# EAGLE design multiplex (EAGLE 7.2.0)

## Sheet 1 of 3
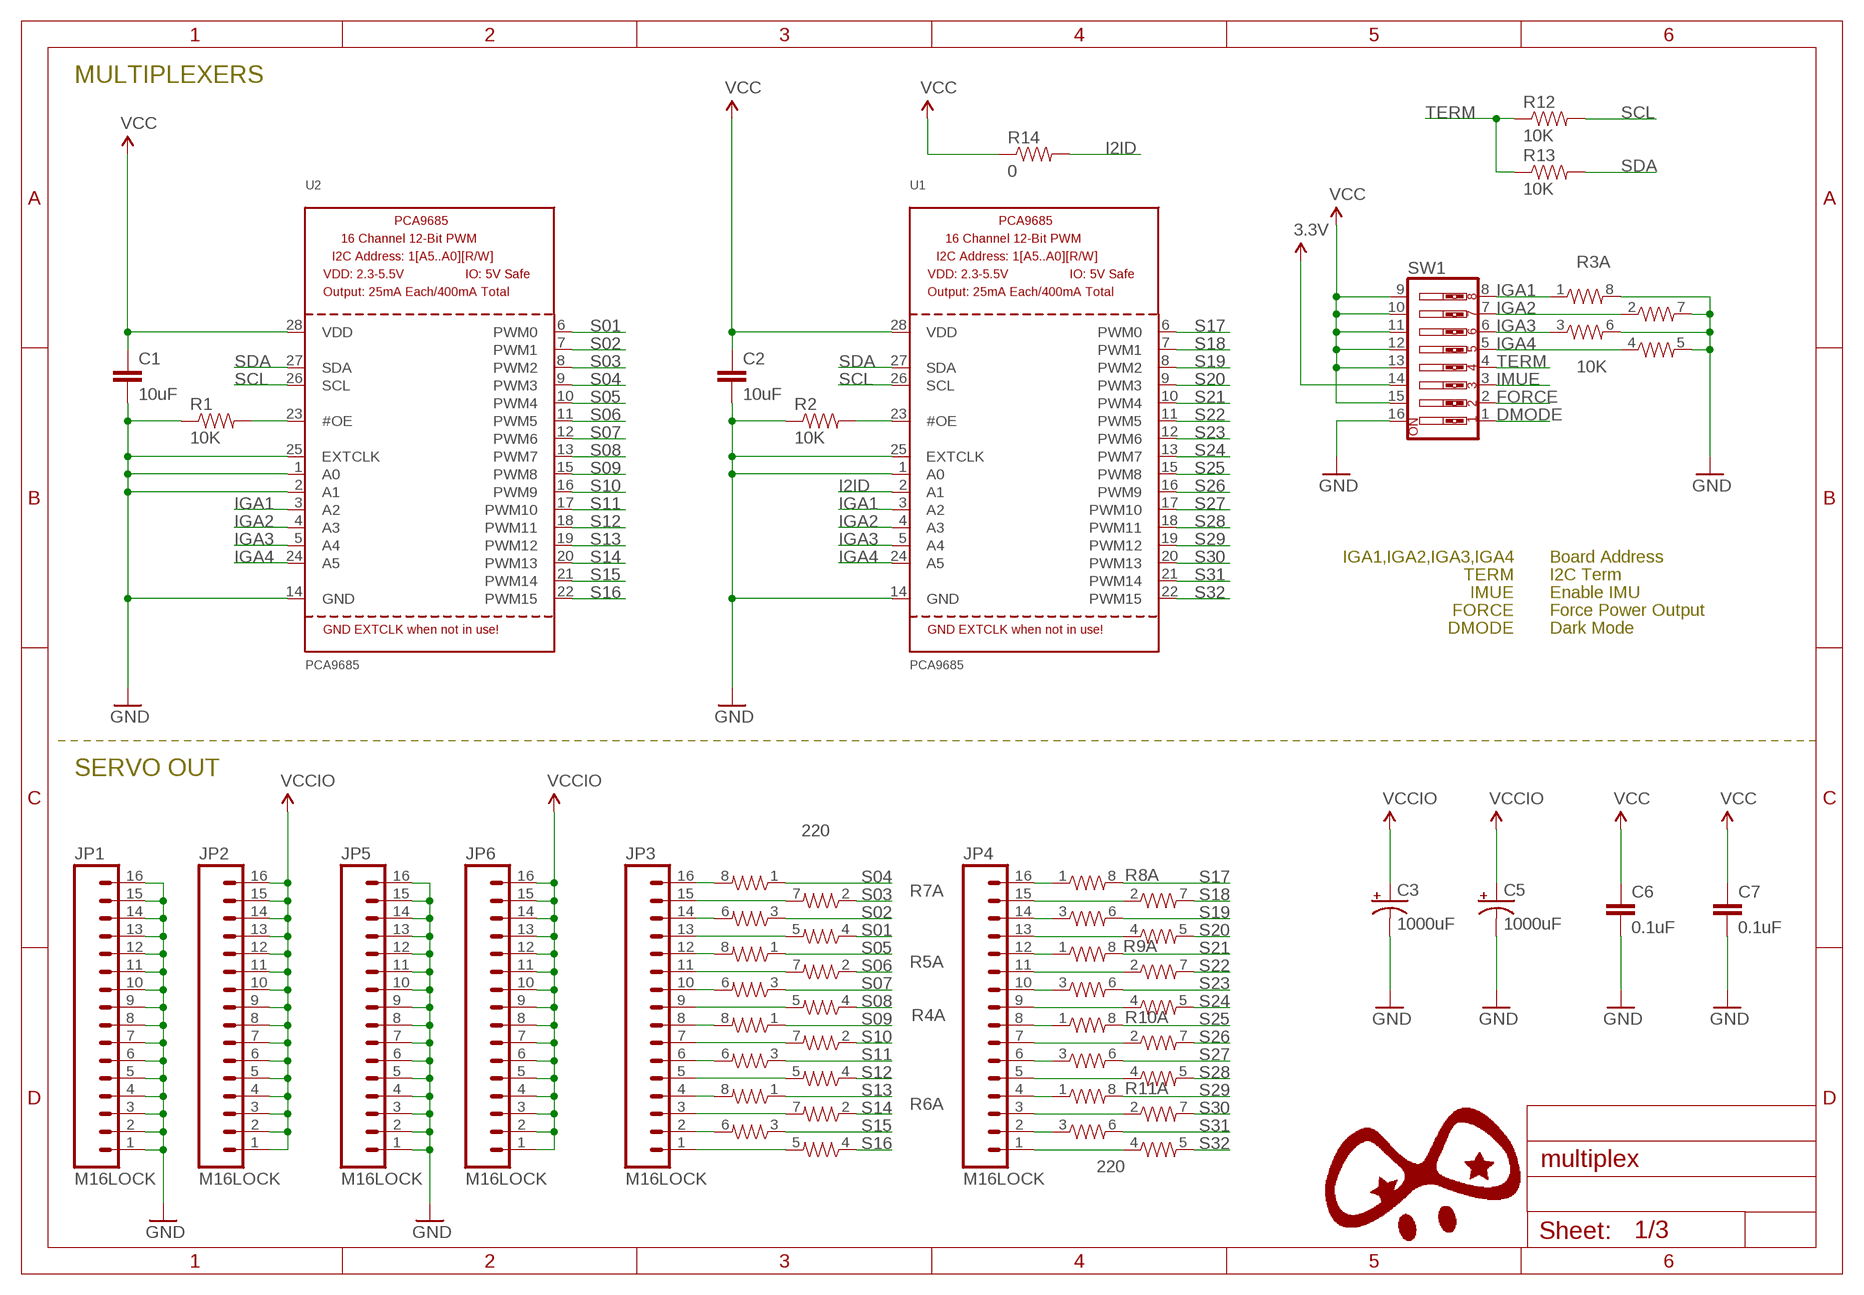
[diagram p0: schematic, sheet 1]

### Parts
C1  10uF  10UF-6.3V-20%(0603)  [0603-CAP]
C2  10uF  10UF-6.3V-20%(0603)  [0603-CAP]
C3  1000uF  CAP_POLD  [PANASONIC_D]
C5  1000uF  CAP_POLD  [PANASONIC_D]
C6  0.1uF  10UF-6.3V-20%(0603)  [0603-CAP]
C7  0.1uF  10UF-6.3V-20%(0603)  [0603-CAP]
JP1  M16LOCK  [1X16_LOCK]
JP2  M16LOCK  [1X16_LOCK]
JP3  M16LOCK  [1X16_LOCK]
JP4  M16LOCK  [1X16_LOCK]
JP5  M16LOCK  [1X16_LOCK]
JP6  M16LOCK  [1X16_LOCK]
R1  10K  RESISTOR0603  [0603-RES]
R2  10K  RESISTOR0603  [0603-RES]
R3  10K  RESISTOR-ARRAY0603-ARV  [0603-ARV]
R4  220  RESISTOR-ARRAY0603-ARV  [0603-ARV]
R5  220  RESISTOR-ARRAY0603-ARV  [0603-ARV]
R6  220  RESISTOR-ARRAY0603-ARV  [0603-ARV]
R7  220  RESISTOR-ARRAY0603-ARV  [0603-ARV]
R8  220  RESISTOR-ARRAY0603-ARV  [0603-ARV]
R9  220  RESISTOR-ARRAY0603-ARV  [0603-ARV]
R10  220  RESISTOR-ARRAY0603-ARV  [0603-ARV]
R11  220  RESISTOR-ARRAY0603-ARV  [0603-ARV]
R12  10K  RESISTOR0603  [0603-RES]
R13  10K  RESISTOR0603  [0603-RES]
R14  0  RESISTOR0603  [0603-RES]
SW1  SW_DIP-8-SMT-HALFSIZE  [DIPSWITCH-08-50MIL]
U1  PCA9685  [TSSOP28]
U2  PCA9685  [TSSOP28]

### Nets
3.3V: SW1.14 ; also sheet 2,3
DMODE: SW1.1 ; also sheet 2
FORCE: SW1.2 ; also sheet 3
GND [PlanGND]: C1.2 C2.2 C3.- C5.- C6.2 C7.2 JP1.1 JP1.2 JP1.3 JP1.4 JP1.5 JP1.6 JP1.7 JP1.8 JP1.9 JP1.10 JP1.11 JP1.12 JP1.13 JP1.14 JP1.15 JP1.16 JP5.1 JP5.2 JP5.3 JP5.4 JP5.5 JP5.6 JP5.7 JP5.8 JP5.9 JP5.10 JP5.11 JP5.12 JP5.13 JP5.14 JP5.15 JP5.16 R1.1 R2.1 R3.5 R3.6 R3.7 R3.8 SW1.16 U1.1(A0) U1.14(GND) U1.25(EXTCLK) U2.1(A0) U2.2(A1) U2.14(GND) U2.25(EXTCLK) ; also sheet 2,3
I2ID: R14.2 U1.2(A1)
IGA1: R3.1 SW1.8 U1.3(A2) U2.3(A2) ; also sheet 3
IGA2: R3.2 SW1.7 U1.4(A3) U2.4(A3) ; also sheet 3
IGA3: R3.3 SW1.6 U1.5(A4) U2.5(A4) ; also sheet 3
IGA4: R3.4 SW1.5 U1.24(A5) U2.24(A5) ; also sheet 3
IMUE: SW1.3 ; also sheet 2
N$1: JP3.16 R7.8
N$2: JP3.15 R7.7
N$3: R1.2 U2.23(#OE)
N$4: R2.2 U1.23(#OE)
N$5: JP3.14 R7.6
N$6: JP3.13 R7.5
N$7: JP3.11 R5.7
N$8: JP3.12 R5.8
N$9: JP3.10 R5.6
N$10: JP3.9 R5.5
N$11: JP3.8 R4.8
N$12: JP3.7 R4.7
N$13: JP3.6 R4.6
N$14: JP3.5 R4.5
N$15: JP3.4 R6.8
N$16: JP3.3 R6.7
N$17: JP3.2 R6.6
N$18: JP3.1 R6.5
N$35: JP4.16 R8.1
N$36: JP4.15 R8.2
N$37: JP4.14 R8.3
N$38: JP4.13 R8.4
N$39: JP4.12 R9.1
N$40: JP4.11 R9.2
N$41: JP4.10 R9.3
N$42: JP4.9 R9.4
N$43: JP4.8 R10.1
N$44: JP4.7 R10.2
N$45: JP4.6 R10.3
N$46: JP4.5 R10.4
N$47: JP4.4 R11.1
N$48: JP4.3 R11.2
N$49: JP4.2 R11.3
N$50: JP4.1 R11.4
S01: R7.4 U2.6(PWM0)
S02: R7.3 U2.7(PWM1)
S03: R7.2 U2.8(PWM2)
S04: R7.1 U2.9(PWM3)
S05: R5.1 U2.10(PWM4)
S06: R5.2 U2.11(PWM5)
S07: R5.3 U2.12(PWM6)
S08: R5.4 U2.13(PWM7)
S09: R4.1 U2.15(PWM8)
S10: R4.2 U2.16(PWM9)
S11: R4.3 U2.17(PWM10)
S12: R4.4 U2.18(PWM11)
S13: R6.1 U2.19(PWM12)
S14: R6.2 U2.20(PWM13)
S15: R6.3 U2.21(PWM14)
S16: R6.4 U2.22(PWM15)
S17: R8.8 U1.6(PWM0)
S18: R8.7 U1.7(PWM1)
S19: R8.6 U1.8(PWM2)
S20: R8.5 U1.9(PWM3)
S21: R9.8 U1.10(PWM4)
S22: R9.7 U1.11(PWM5)
S23: R9.6 U1.12(PWM6)
S24: R9.5 U1.13(PWM7)
S25: R10.8 U1.15(PWM8)
S26: R10.7 U1.16(PWM9)
S27: R10.6 U1.17(PWM10)
S28: R10.5 U1.18(PWM11)
S29: R11.8 U1.19(PWM12)
S30: R11.7 U1.20(PWM13)
S31: R11.6 U1.21(PWM14)
S32: R11.5 U1.22(PWM15)
SCL: R12.2 U1.26(SCL) U2.26(SCL) ; also sheet 2,3
SDA: R13.2 U1.27(SDA) U2.27(SDA) ; also sheet 2,3
TERM: R12.1 R13.1 SW1.4
VCC: C1.1 C2.1 C6.1 C7.1 R14.1 SW1.9 SW1.10 SW1.11 SW1.12 SW1.13 SW1.15 U1.28(VDD) U2.28(VDD) ; also sheet 2,3
VCCIO: C3.+ C5.+ JP2.1 JP2.2 JP2.3 JP2.4 JP2.5 JP2.6 JP2.7 JP2.8 JP2.9 JP2.10 JP2.11 JP2.12 JP2.13 JP2.14 JP2.15 JP2.16 JP6.1 JP6.2 JP6.3 JP6.4 JP6.5 JP6.6 JP6.7 JP6.8 JP6.9 JP6.10 JP6.11 JP6.12 JP6.13 JP6.14 JP6.15 JP6.16 ; also sheet 2,3

### Notes on the sheet
- MULTIPLEXERS
- IGA1,IGA2,IGA3,IGA4 | Board Address
- TERM | I2C Term
- IMUE | Enable IMU
- FORCE | Force Power Output
- DMODE | Dark Mode
- SERVO OUT

## Sheet 2 of 3
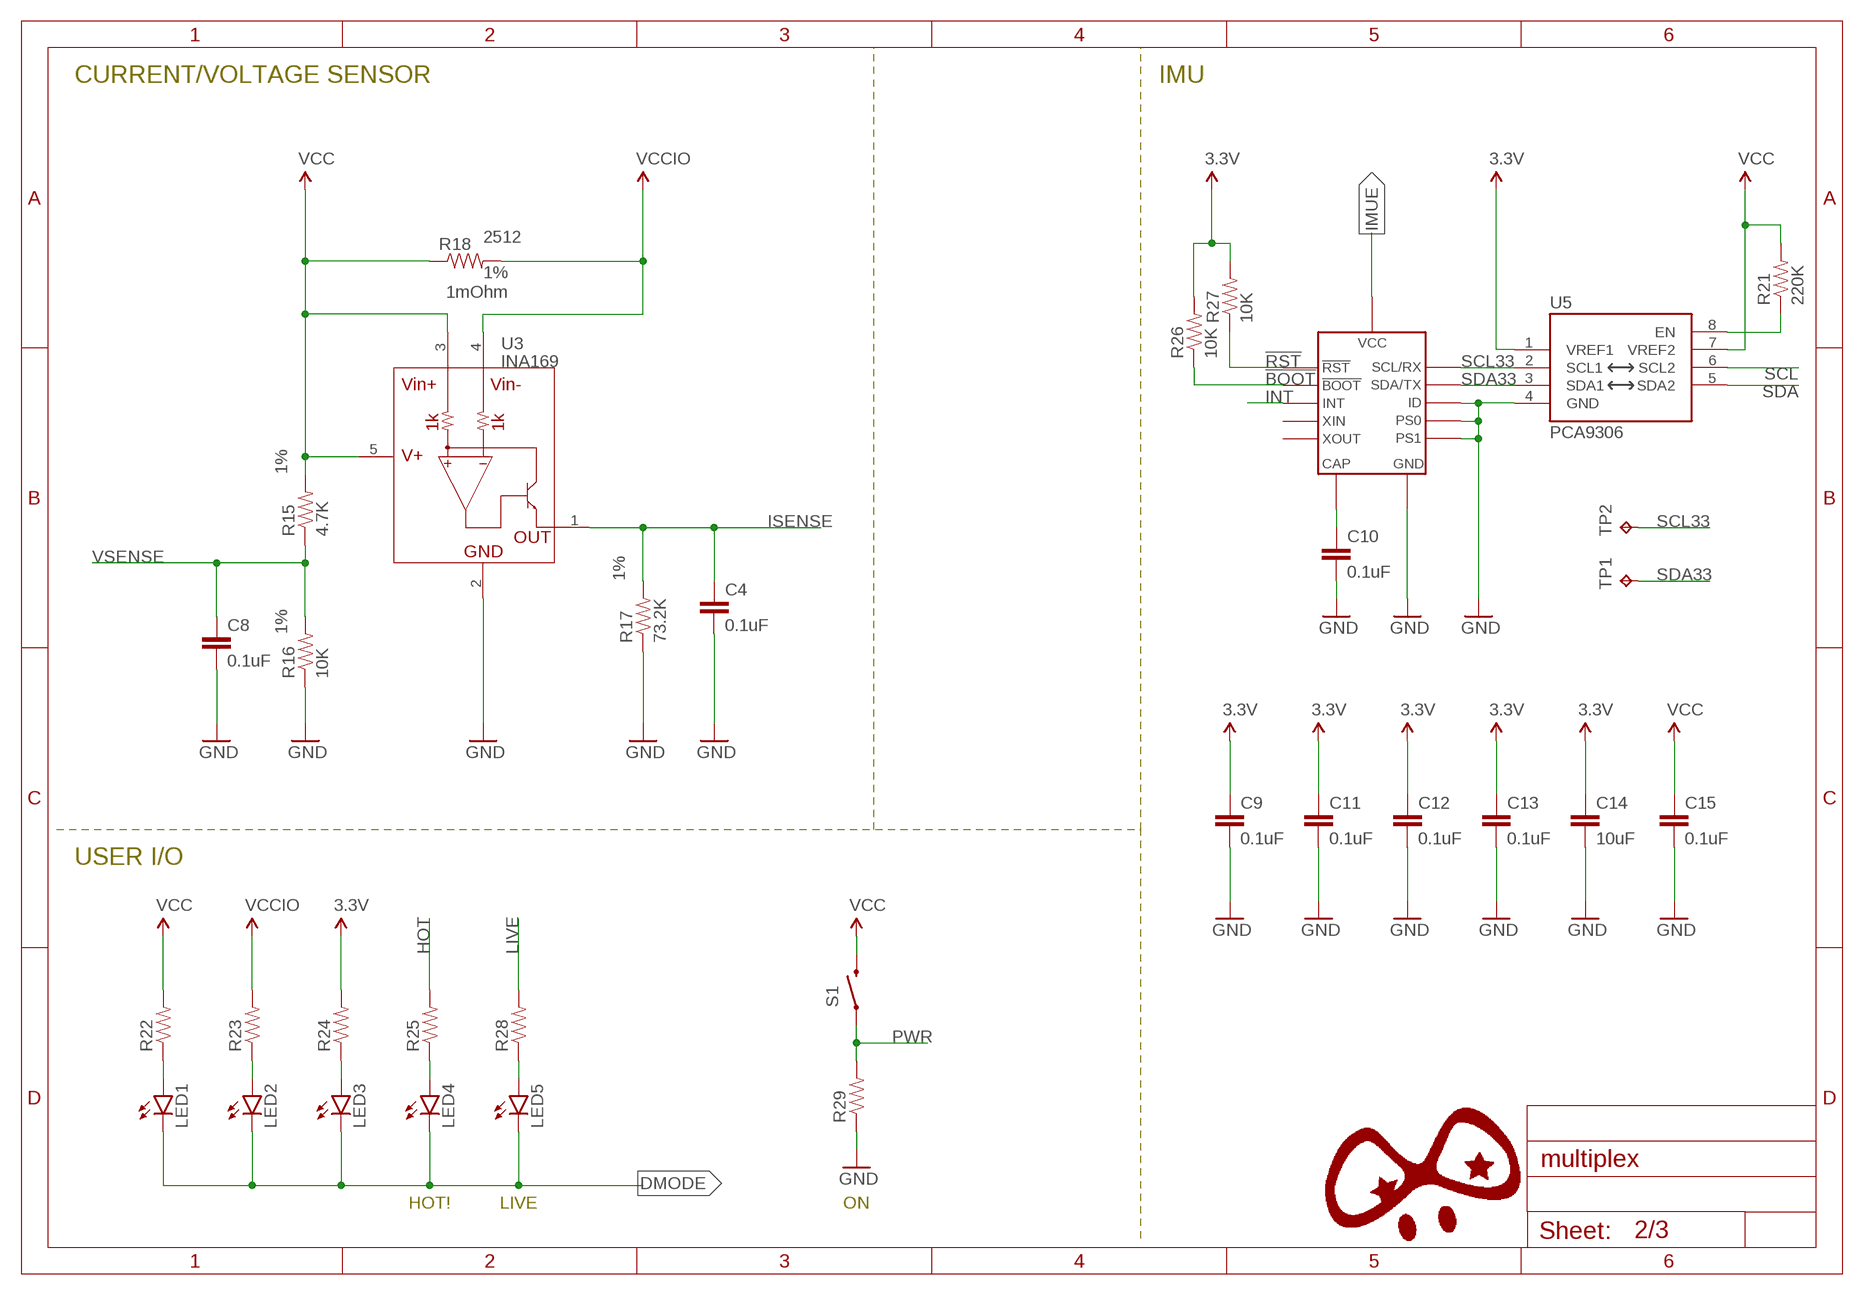
[diagram p1: schematic, sheet 2]

### Parts
C4  0.1uF  10UF-6.3V-20%(0603)  [0603-CAP]
C8  0.1uF  10UF-6.3V-20%(0603)  [0603-CAP]
C9  0.1uF  10UF-6.3V-20%(0603)  [0603-CAP]
C10  0.1uF  10UF-6.3V-20%(0603)  [0603-CAP]
C11  0.1uF  10UF-6.3V-20%(0603)  [0603-CAP]
C12  0.1uF  10UF-6.3V-20%(0603)  [0603-CAP]
C13  0.1uF  10UF-6.3V-20%(0603)  [0603-CAP]
C14  10uF  10UF-6.3V-20%(0603)  [0603-CAP]
C15  0.1uF  10UF-6.3V-20%(0603)  [0603-CAP]
LED1  LED0603  [LED-0603]
LED2  LED0603  [LED-0603]
LED3  LED0603  [LED-0603]
LED4  LED0603  [LED-0603]
LED5  LED0603  [LED-0603]
R15  4.7K  RESISTOR0603  [0603-RES]
R16  10K  RESISTOR0603  [0603-RES]
R17  73.2K  RESISTOR0603  [0603-RES]
R18  1mOhm  RESISTOR2512  [R2512]
R21  220K  RESISTOR0603-RES  [0603-RES]
R22  RESISTOR0603-RES  [0603-RES]
R23  RESISTOR0603-RES  [0603-RES]
R24  RESISTOR0603-RES  [0603-RES]
R25  RESISTOR0603-RES  [0603-RES]
R26  10K  RESISTOR0603  [0603-RES]
R27  10K  RESISTOR0603  [0603-RES]
R28  RESISTOR0603-RES  [0603-RES]
R29  RESISTOR0603-RES  [0603-RES]
S1  SWITCH-MOMENTARY-2SMD  [TACTILE-SWITCH-SMD]
TP1  TPB1,27  [B1,27]
TP2  TPB1,27  [B1,27]
U3  INA169  [SOT23-5]
U4  BNO055  [BNO055]
U5  PCA9306  PCA9306PCA9306DC-1:1  [PCA9306DC-1:1]

### Nets
3.3V: C9.1 C11.1 C12.1 C13.1 C14.1 R24.2 R26.2 R27.2 U5.1(VREF1) ; also sheet 1,3
!BOOT: R26.1 U4.4(BOOT)
!RST: R27.1 U4.1(RST)
DMODE: LED1.C LED2.C LED3.C LED4.C LED5.C ; also sheet 1
GND [PlanGND]: C4.2 C8.2 C9.2 C10.2 C11.2 C12.2 C13.2 C14.2 C15.2 R16.1 R17.1 R29.1 U3.2(GND) U4.2(GND) U4.5(PS1) U4.6(PS0) U4.10(GND) U4.15(GND) U4.16(GND) U4.17(ID) U4.18(GND) U4.25(GND) U5.4(GND) ; also sheet 1,3
HOT: R25.2
IMUE: U4.3(VCC) U4.28(VCC) ; also sheet 1
INT: U4.14(INT)
ISENSE: C4.1 R17.2 U3.1(OUT)
LIVE: R28.2
N$19: LED1.A R22.1
N$20: R21.1 U5.8(EN)
N$21: LED5.A R28.1
N$22: LED2.A R23.1
N$24: C10.1 U4.9(CAP)
N$25: LED3.A R24.1
N$27: LED4.A R25.1
PWR: R29.2 S1.1
SCL: U5.6(SCL2) ; also sheet 1,3
SCL33: TP2.TP U4.19(SCL/RX) U5.2(SCL1)
SDA: U5.5(SDA2) ; also sheet 1,3
SDA33: TP1.TP U4.20(SDA/TX) U5.3(SDA1)
VCC: C15.1 R15.2 R18.1 R21.2 R22.2 S1.3 U3.3(VIN+) U3.5(V+) U5.7(VREF2) ; also sheet 1,3
VCCIO: R18.2 R23.2 U3.4(VIN-) ; also sheet 1,3
VSENSE: C8.1 R15.1 R16.2
Unconnected: U4.26(XOUT) U4.27(XIN)

### Notes on the sheet
- CURRENT/VOLTAGE SENSOR | IMU
- USER I/O
- HOT! | LIVE | ON

## Sheet 3 of 3
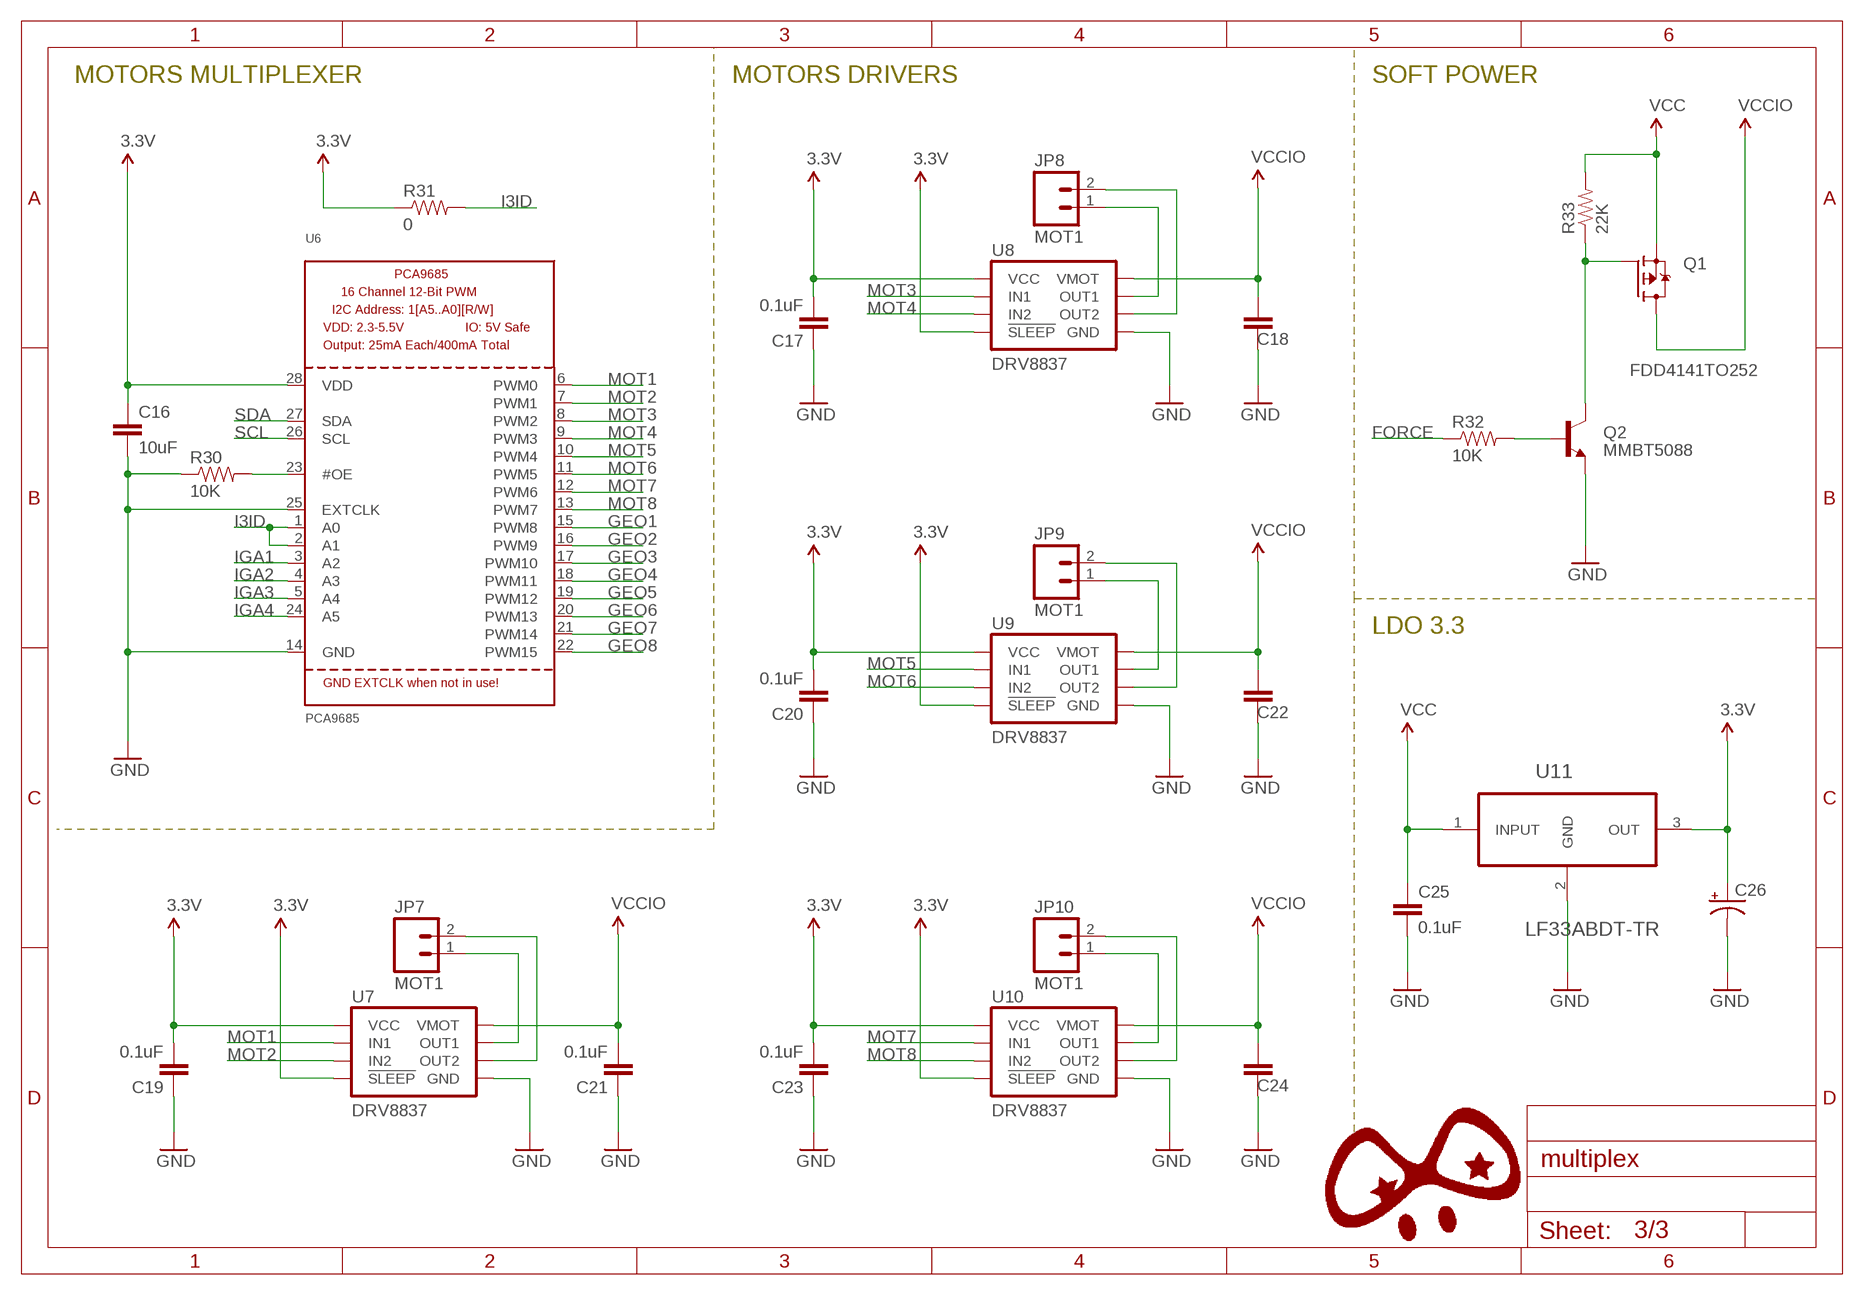
[diagram p2: schematic, sheet 3]

### Parts
C16  10uF  10UF-6.3V-20%(0603)  [0603-CAP]
C17  0.1uF  CAP0603-CAP  [0603-CAP]
C18  0.1uF  CAP0603-CAP  [0603-CAP]
C19  0.1uF  CAP0603-CAP  [0603-CAP]
C20  0.1uF  CAP0603-CAP  [0603-CAP]
C21  0.1uF  CAP0603-CAP  [0603-CAP]
C22  0.1uF  CAP0603-CAP  [0603-CAP]
C23  0.1uF  CAP0603-CAP  [0603-CAP]
C24  0.1uF  CAP0603-CAP  [0603-CAP]
C25  0.1uF  CAP1210  [1210]
C26  CAP_POLD  [PANASONIC_D]
JP7  MOT1  M02POLAR  [MOLEX-1X2]
JP8  MOT1  M02POLAR  [MOLEX-1X2]
JP9  MOT1  M02POLAR  [MOLEX-1X2]
JP10  MOT1  M02POLAR  [MOLEX-1X2]
Q1  FDD4141TO252  [TO252]
Q2  MMBT5088  TRANSISTOR_NPNMMBT5088  [SOT23-3]
R30  10K  RESISTOR0603  [0603-RES]
R31  0  RESISTOR0603  [0603-RES]
R32  10K  RESISTOR0603  [0603-RES]
R33  22K  RESISTOR0603  [0603-RES]
U6  PCA9685  [TSSOP28]
U7  DRV8837  [DSG]
U8  DRV8837  [DSG]
U9  DRV8837  [DSG]
U10  DRV8837  [DSG]
U11  LF33ABDT-TR  [TO228P972X240-3N]

### Nets
3.3V: C16.1 C17.2 C19.2 C20.2 C23.2 C26.+ R31.1 U6.28(VDD) U7.7(!SLEEP) U7.8(VCC) U8.7(!SLEEP) U8.8(VCC) U9.7(!SLEEP) U9.8(VCC) U10.7(!SLEEP) U10.8(VCC) U11.3(OUT) ; also sheet 1,2
FORCE: R32.1 ; also sheet 1
GEO1: U6.15(PWM8)
GEO2: U6.16(PWM9)
GEO3: U6.17(PWM10)
GEO4: U6.18(PWM11)
GEO5: U6.19(PWM12)
GEO6: U6.20(PWM13)
GEO7: U6.21(PWM14)
GEO8: U6.22(PWM15)
GND [PlanGND]: C16.2 C17.1 C18.1 C19.1 C20.1 C21.1 C22.1 C23.1 C24.1 C25.2 C26.- Q2.2(E) R30.1 U6.14(GND) U6.25(EXTCLK) U7.4(GND) U7.PAD(GND) U8.4(GND) U8.PAD(GND) U9.4(GND) U9.PAD(GND) U10.4(GND) U10.PAD(GND) U11.2(GND) ; also sheet 1,2
I3ID: R31.2 U6.1(A0) U6.2(A1)
IGA1: U6.3(A2) ; also sheet 1
IGA2: U6.4(A3) ; also sheet 1
IGA3: U6.5(A4) ; also sheet 1
IGA4: U6.24(A5) ; also sheet 1
MOT1: U6.6(PWM0) U7.6(IN1)
MOT2: U6.7(PWM1) U7.5(IN2)
MOT3: U6.8(PWM2) U8.6(IN1)
MOT4: U6.9(PWM3) U8.5(IN2)
MOT5: U6.10(PWM4) U9.6(IN1)
MOT6: U6.11(PWM5) U9.5(IN2)
MOT7: U6.12(PWM6) U10.6(IN1)
MOT8: U6.13(PWM7) U10.5(IN2)
N$23: R30.2 U6.23(#OE)
N$26: JP7.1 U7.2(OUT1)
N$28: JP7.2 U7.3(OUT2)
N$29: JP8.1 U8.2(OUT1)
N$30: JP8.2 U8.3(OUT2)
N$31: JP9.1 U9.2(OUT1)
N$32: JP9.2 U9.3(OUT2)
N$33: JP10.1 U10.2(OUT1)
N$34: Q2.1(B) R32.2
N$52: Q1.1(G) Q2.3(C) R33.1
N$66: JP10.2 U10.3(OUT2)
SCL: U6.26(SCL) ; also sheet 1,2
SDA: U6.27(SDA) ; also sheet 1,2
VCC: C25.1 Q1.2(S) R33.2 U11.1(INPUT) ; also sheet 1,2
VCCIO: C18.2 C21.2 C22.2 C24.2 Q1.3(D) U7.1(VMOT) U8.1(VMOT) U9.1(VMOT) U10.1(VMOT) ; also sheet 1,2

### Notes on the sheet
- MOTORS MULTIPLEXER | MOTORS DRIVERS | SOFT POWER
- LDO 3.3

## Library data of the parts
C1 C2 C14 C16 = SparkFun-Capacitors:10UF-6.3V-20%(0603): CAP-11015; PROD_ID: CAP-11015
C3 C5 C26 = SparkFun-Capacitors:CAP_POL: Capacitor Polarized These are standard SMD and PTH capacitors. Normally 10uF, 47uF, and 100uF in electrolytic and tantalum varieties. Always verify the external diameter of the through hole cap, it varies with capacity, voltage, and manufacturer. The EIA devices should be standard.
C4 C6-C13 C15 = SparkFun-Capacitors:10UF-6.3V-20%(0603): CAP-11015; PROD_ID: CAP-11015; VALUE: 10uF
C17-C24 = SparkFun-Passives:CAP: Capacitor Standard 0603 ceramic capacitor, and 0.1" leaded capacitor.
C25 = SparkFun-Capacitors:CAP: Capacitor Standard 0603 ceramic capacitor, and 0.1" leaded capacitor.
JP1-JP6 = SparkFun-Connectors:M16: 1x16 .1" header
JP7-JP10 = SparkFun-Connectors:M02: Standard 2-pin 0.1" header. Use with - straight break away headers ( PRT-00116) - right angle break away headers (PRT-00553) - swiss pins (PRT-00743) - machine pins (PRT-00117) - female headers (PRT-00115) Molex polarized connector foot print use with: PRT-08233 with associated crimp pins and housings. 2.54_SCREWTERM for use with PRT-10571. 3.5mm Screw Terminal footprints for PRT-08084 5mm Screw Terminal footprints for use with PRT-08432
LED1-LED5 = SparkFun-LED:LED: LEDs Standard schematic elements and footprints for 5mm, 3mm, 1206, and 0603 sized LEDs. 5mm - Spark Fun Electronics SKU : COM-00529 (and others)
Q1 = transistor-fet:FDD4141: P-Channel PowerTrench® MOSFET Source: FDD4141.pdf
Q2 = SparkFun-DiscreteSemi:TRANSISTOR_NPN: Generic NPN BJT MMBT2222A - TRANS-08049 (SOT-23, 1A 40V) MPSA42 - TRANS-09116 (SOT-23, 500mA 300V) MMBT5088LT1G - TRANS-11160 (SOT-23, 50 mA 30V) BC547 - COM-08928 <http://www.sparkfun.com/products/8928> (TO-92 45V 100mA) (1.Collector 2.Base 3.Emitter) 2N3904 - COM-00521 <http://www.sparkfun.com/products/521> (TO-92 40V 200mA) (1.Emitter 2.Base 3.Collector) P2N2222A - COM-12852 <http://www.sparkfun.com/products/12852> (TO-92 40V 600mA) (1.Collector 2.Base 3.Emitter); PROD_ID: TRANS-11160
R1 R2 R12-R14 R21-R33 = SparkFun-Resistors:RESISTOR: Resistor Basic schematic elements and footprints for 0603, 1206, and PTH resistors.
R3-R11 = SparkFun-Resistors:RESISTOR-ARRAY: Array Chip Resistor Source: RS Component / Phycomp
R15-R17 = SparkFun-Resistors:RESISTOR: Resistor Basic schematic elements and footprints for 0603, 1206, and PTH resistors.; TOL: 1%
R18 = SparkFun-Resistors:RESISTOR: Resistor Basic schematic elements and footprints for 0603, 1206, and PTH resistors.; SIZE: 2512; TOL: 1%
S1 = SparkFun-Electromechanical:SWITCH-MOMENTARY-2: Various NO switches- pushbuttons, reed, etc; PROD_ID: SWCH-08247
SW1 = SparkFun-Electromechanical:SW_DIP-8: DIP Switch 8 Position
TP1 TP2 = testpad:TP: Test pad
U1 U2 U6 = microbuilder:PCA9685: PCA9685 - 16 Channel 12-Bit I2C PWM Controller 5.0V tolerant 16 channel, 12-bit I2C PWM controller with 25mA per output (max. 400mA total) Digikey: 568-5931-1-ND
U3 = SparkFun-AnalogIC:INA169
U4 = alvaroferran:BNO055: The BNO055 is a System in Package (SiP), integrating a triaxial 14-bit accelerometer, a triaxial 16-bit gyroscope with a range of ±2000 degrees per second, a triaxial geomagnetic sensor and a 32-bit microcontroller running the company’s BSX3.0 FusionLib software. At just 5.2 x 3.8 x 1.1 mm3, it is significantly smaller than comparable discrete or system-on-board solutions.
U5 = SparkFun-DigitalIC:PCA9306: Bidirectional I2C level shifter. NOT compatible with all available part number pinout schemes- DOUBLE CHECK!!!; PROD_ID: IC-10023
U7-U10 = packages(ti):DRV8837
U11 = STM-LF33ABDT-TR:LF33ABDT-TR: LDO, 0.45VDO, 1A, 3.3V, 1%, 3TO252; MPN: LF33ABDT-TR; OC_FARNELL: 2253503; OC_NEWARK: 26M0226; PACKAGE: DPAK; SUPPLIER: STMicroelectronics

## Board
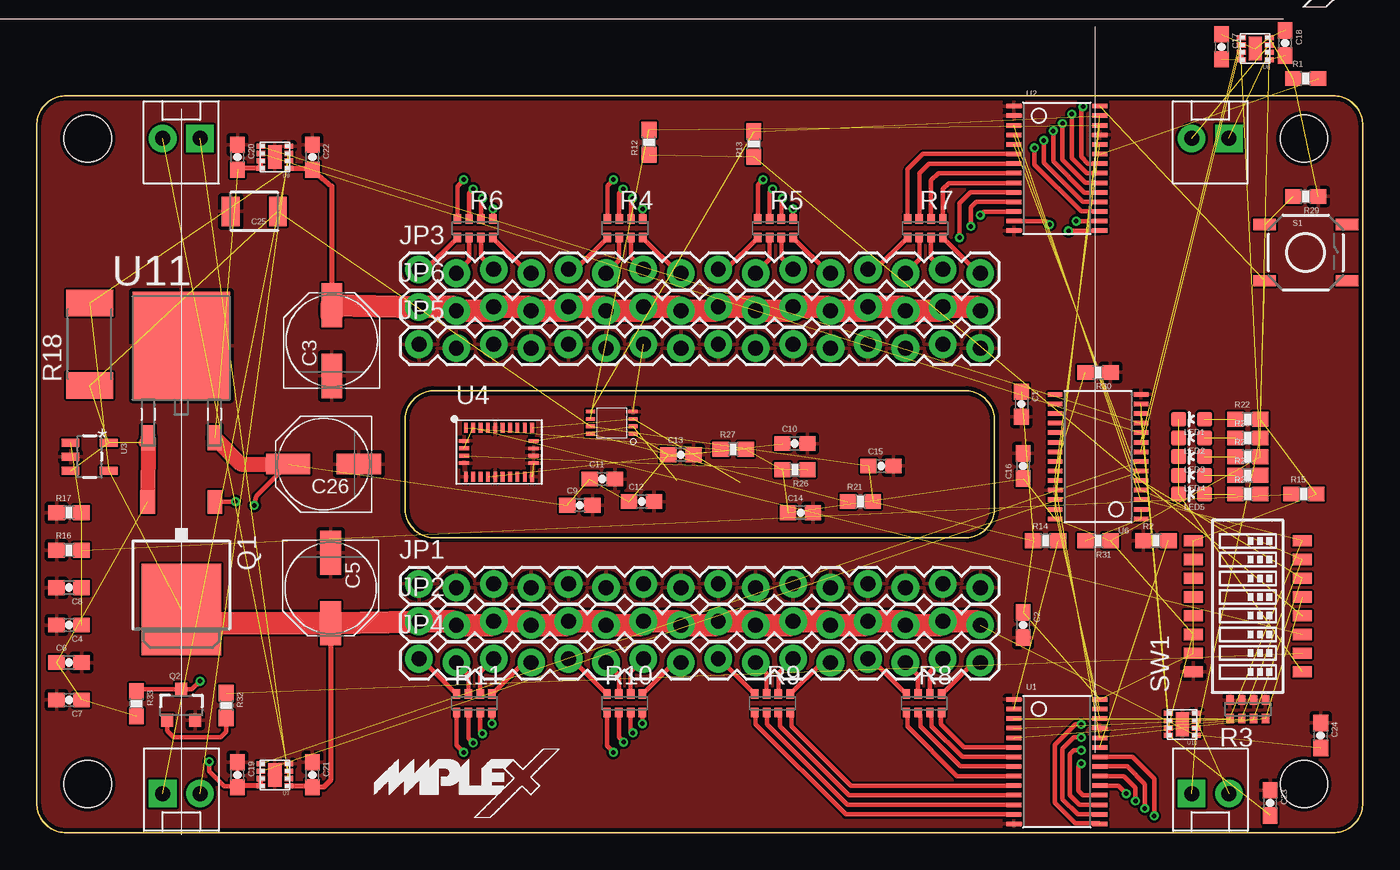
[diagram p3: board, top side]
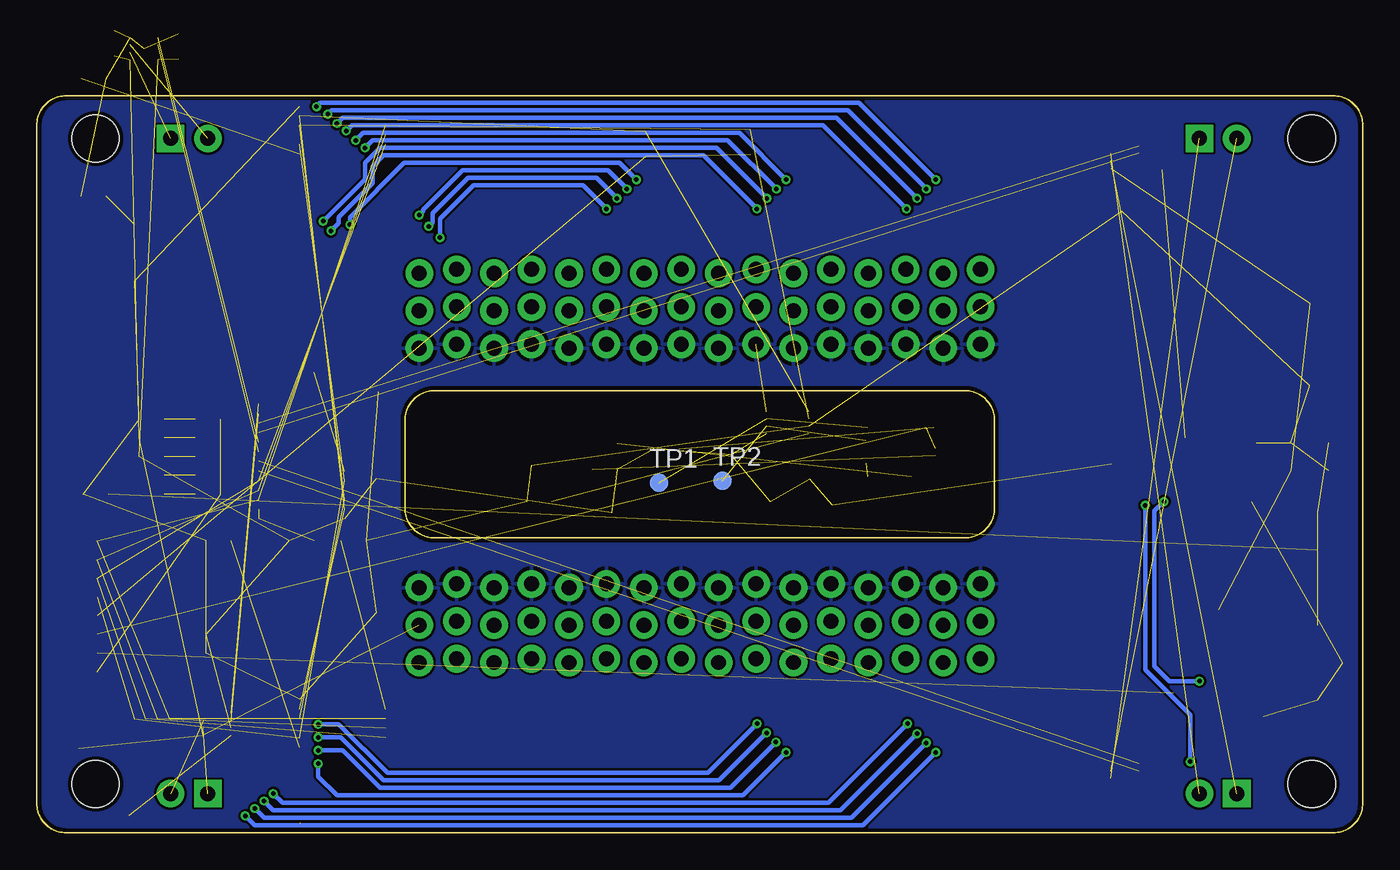
[diagram p4: board, bottom side, seen from below]

Size 90 x 50 mm. Coordinates in mm from the lower left corner, seen from the top.
Outline: 90,1.86 89.99,1.73 89.96,1.6 89.93,1.47 89.89,1.34 89.79,1.1 89.73,0.99 89.66,0.88 89.59,0.78 89.5,0.68 89.32,0.5 89.22,0.42 89.12,0.34 89.01,0.27 88.9,0.21 88.66,0.11 88.53,0.07 88.4,0.04 88.27,0.01 88.14,0 1.86,0 1.73,0.01 1.6,0.04 1.47,0.07 1.34,0.11 1.1,0.21 0.99,0.27 0.88,0.34 0.78,0.42 0.68,0.5 0.5,0.68 0.42,0.78 0.34,0.88 0.27,0.99 0.21,1.1 0.11,1.34 0.07,1.47 0.04,1.6 0.01,1.73 0,1.86 0,48.14 0.01,48.27 0.04,48.4 0.07,48.53 0.11,48.66 0.16,48.78 0.21,48.9 0.27,49.01 0.34,49.12 0.42,49.22 0.5,49.32 0.68,49.5 0.78,49.59 0.88,49.66 0.99,49.73 1.1,49.79 1.34,49.89 1.47,49.93 1.6,49.96 1.73,49.99 1.86,50 88.14,50 88.27,49.99 88.4,49.96 88.53,49.93 88.66,49.89 88.9,49.79 89.01,49.73 89.12,49.66 89.22,49.59 89.32,49.5 89.5,49.32 89.59,49.22 89.73,49.01 89.79,48.9 89.84,48.78 89.89,48.66 89.93,48.53 89.96,48.4 89.99,48.27 90,48.14 90,1.86
Outline: 65,21.86 64.99,21.73 64.96,21.6 64.93,21.47 64.89,21.34 64.79,21.1 64.73,20.99 64.66,20.88 64.59,20.78 64.5,20.68 64.32,20.5 64.22,20.42 64.12,20.34 64.01,20.27 63.9,20.21 63.66,20.11 63.53,20.07 63.4,20.04 63.27,20.01 63.14,20 26.86,20 26.73,20.01 26.6,20.04 26.47,20.07 26.34,20.11 26.1,20.21 25.99,20.27 25.88,20.34 25.78,20.42 25.68,20.5 25.5,20.68 25.42,20.78 25.34,20.88 25.27,20.99 25.21,21.1 25.11,21.34 25.07,21.47 25.04,21.6 25.01,21.73 25,21.86 25,28.14 25.01,28.27 25.04,28.4 25.07,28.53 25.11,28.66 25.21,28.9 25.27,29.01 25.34,29.12 25.42,29.22 25.5,29.32 25.68,29.5 25.78,29.59 25.88,29.66 25.99,29.73 26.1,29.79 26.34,29.89 26.47,29.93 26.6,29.96 26.73,29.99 26.86,30 63.14,30 63.27,29.99 63.4,29.96 63.53,29.93 63.66,29.89 63.9,29.79 64.01,29.73 64.12,29.66 64.22,29.59 64.32,29.5 64.5,29.32 64.59,29.22 64.66,29.12 64.73,29.01 64.79,28.9 64.89,28.66 64.93,28.53 64.96,28.4 64.99,28.27 65,28.14 65,21.86
Copper layers (1*16): Top 0.035mm / dielectric 1.5mm / Bottom 0.035mm
Design rules "pighixxx_CAM_DRC_V1.5": minimum track width 6mil, minimum drill 10mil, track to track 6mil, track to pad 6mil, pad to pad 6mil, via to via 6mil, smd to smd 0mil, copper to edge 10mil, drill to drill 10mil, minimum pad ring 10mil, minimum via ring 6mil, stop-mask expansion 2mil, vias tented up to drill 100mil, thermal gap 10mil
Holes 3.2 mm at 3.46,47.11 86.01,47.11 86.01,3.29 3.46,3.29

### Footprints (pad centres in the part's own frame; a part is rotated, then mirrored left to right if it is on the bottom)
0603-CAP = smd 1.1 x 1: 1 -0.85,0; 2 0.85,0
PANASONIC_D = smd 3 x 1.4: + 2.4,0; - -2.4,0
1210 = smd 1.2 x 2: 1 -1.6,0; 2 1.6,0
1X16_LOCK = drill 1.016 pad 1.88: 1 0,0.127; 2 2.54,-0.127; 3 5.08,0.127; 4 7.62,-0.127; 5 10.16,0.127; 6 12.7,-0.127; 7 15.24,0.127; 8 17.78,-0.127; 9 20.32,0.127; 10 22.86,-0.127; 11 25.4,0.127; 12 27.94,-0.127; 13 30.48,0.127; 14 33.02,-0.127; 15 35.56,0.127; 16 38.1,-0.127
MOLEX-1X2 = drill 1.016 pad 1.88 square: 1 0,0 | drill 1.016 pad 1.88: 2 2.54,0
LED-0603 = smd 1 x 1: A 0,-0.877; C 0,0.877
TO252 = smd 1 x 1.6: 1 -2.28,-4.8; 2 2.28,-4.8 | smd 5.4 x 6.2: 3 0,2.5
SOT23-3 = smd 0.8 x 0.9: 1 -0.95,-1; 2 0.95,-1; 3 0,1.1
0603-RES = smd 1.1 x 1: 1 -0.85,0; 2 0.85,0
0603-ARV = smd 0.5 x 0.65: 1 -1.2,-0.625; 2 -0.4,-0.625; 3 0.4,-0.625; 4 1.2,-0.625; 5 1.2,0.625; 6 0.4,0.625; 7 -0.4,0.625; 8 -1.2,0.625
R2512 = smd 1.8 x 3.2: 1 -2.8,0; 2 2.8,0
TACTILE-SWITCH-SMD = smd 1.524 x 0.762: 1 -2.794,1.905; 2 2.794,1.905; 3 -2.794,-1.905; 4 2.794,-1.905
DIPSWITCH-08-50MIL = smd 0.762 x 1.27: 1 -4.445,-3.7; 2 -3.175,-3.7; 3 -1.905,-3.7; 4 -0.635,-3.7; 5 0.635,-3.7; 6 1.905,-3.7; 7 3.175,-3.7; 8 4.445,-3.7; 9 4.445,3.7; 10 3.175,3.7; 11 1.905,3.7; 12 0.635,3.7; 13 -0.635,3.7; 14 -1.905,3.7; 15 -3.175,3.7; 16 -4.445,3.7
B1,27 = smd 1.27 x 1.27: TP 0,0
TSSOP28 = smd 0.305 x 0.991: 1 -4.225,-2.918; 2 -3.575,-2.918; 3 -2.925,-2.918; 4 -2.275,-2.918; 5 -1.625,-2.918; 6 -0.975,-2.918; 7 -0.325,-2.918; 8 0.325,-2.918; 9 0.975,-2.918; 10 1.625,-2.918; 11 2.275,-2.918; 12 2.925,-2.918; 13 3.575,-2.918; 14 4.225,-2.918; 15 4.225,2.918; 16 3.575,2.918; 17 2.925,2.918; 18 2.275,2.918; 19 1.625,2.918; 20 0.975,2.918; 21 0.325,2.918; 22 -0.325,2.918; 23 -0.975,2.918; 24 -1.625,2.918; 25 -2.275,2.918; 26 -2.925,2.918; 27 -3.575,2.918; 28 -4.225,2.918
SOT23-5 = smd 0.55 x 1.2: 1 -0.95,-1.3; 2 0,-1.3; 3 0.95,-1.3; 4 0.95,1.3; 5 -0.95,1.3
BNO055 = smd 0.25 x 0.68: 1 -2.279,1.72; 6 -2.279,-1.606; 7 -1.779,-1.606; 8 -1.279,-1.606; 9 -0.779,-1.606; 10 -0.279,-1.606; 11 0.221,-1.606; 12 0.721,-1.606; 13 1.221,-1.606; 14 1.721,-1.606; 15 2.221,-1.606; 20 2.221,1.72; 21 1.721,1.72; 22 1.221,1.72; 23 0.721,1.72; 24 0.221,1.72; 25 -0.279,1.72; 26 -0.779,1.72; 27 -1.279,1.72; 28 -1.779,1.72 | smd 0.68 x 0.25: 2 -2.387,0.809; 3 -2.387,0.309; 4 -2.387,-0.191; 5 -2.387,-0.691; 16 2.332,-0.692; 17 2.332,-0.192; 18 2.332,0.308; 19 2.332,0.808
PCA9306DC-1:1 = smd 0.25 x 0.602: 1 -0.73,-1.446; 2 -0.23,-1.446; 3 0.27,-1.446; 4 0.77,-1.446; 5 0.77,1.431; 6 0.27,1.431; 7 -0.23,1.431; 8 -0.73,1.431
DSG = smd 0.6 x 0.35: 1 -0.95,0.75; 2 -0.95,0.25; 3 -0.95,-0.25; 4 -0.95,-0.75; 5 0.95,-0.75; 6 0.95,-0.25; 7 0.95,0.25; 8 0.95,0.75 | smd 0.9 x 1.6: PAD 0,0
TO228P972X240-3N = smd 0.94 x 1.702: 1 -2.261,-6.096; 3 2.261,-6.096 | smd 6.604 x 7.315: 2 0,0.152

### Placement (x,y rotation side)
C1  66.83,29.07 270 top
C2  66.96,14.09 270 top
C3  20.02,33.39 90 top
C4  2.19,14.09 180 top
C5  19.94,16.6 270 top
C6  2.19,11.55 0 top
C7  2.19,9.01 180 top
C8  2.19,16.63 180 top
C9  36.86,22.22 0 top
C10  51.46,26.41 0 top
C11  38.38,23.99 0 top
C12  41.05,22.47 0 top
C13  43.72,25.64 0 top
C14  51.84,21.71 0 top
C15  57.31,24.88 0 top
C16  66.96,24.88 90 top
C17  80.42,53.33 270 top
C18  84.74,53.58 270 top
C19  13.62,3.93 270 top
C20  13.62,45.84 270 top
C21  18.7,3.93 270 top
C22  18.7,45.84 270 top
C23  83.72,2.02 270 top
C24  87.15,6.59 270 top
C25  14.76,42.15 180 top
C26  19.46,25.01 180 top
JP1  25.94,16.75 0 top
JP2  25.94,14.21 0 top
JP3  25.94,38.09 0 top
JP4  25.94,11.67 0 top
JP5  25.94,33.01 0 top
JP6  25.94,35.55 0 top
JP7  11.08,47.11 180 top
JP8  80.93,47.11 180 top
JP9  8.54,2.66 0 top
JP10  78.39,2.66 0 top
LED1  78.39,28.06 90 top
LED2  78.39,26.79 90 top
LED3  78.39,25.52 90 top
LED4  78.39,24.25 90 top
LED5  78.39,22.98 90 top
Q1  9.81,17.64 180 top
Q2  9.81,8.63 0 top
R1  86.13,51.17 0 top
R2  75.97,19.8 0 top
R3  82.2,8.37 0 top
R4  39.93,41.01 180 top
R5  50.14,41.01 180 top
R6  29.75,41.01 180 top
R7  60.3,41.01 180 top
R8  60.23,8.78 180 top
R9  49.94,8.78 180 top
R10  39.91,8.78 180 top
R11  29.7,8.78 180 top
R12  41.56,46.85 90 top
R13  48.67,46.73 90 top
R14  68.48,19.8 0 top
R15  86.01,22.98 0 top
R16  2.19,19.17 0 top
R17  2.19,21.71 0 top
R18  3.58,33.14 90 top
R21  55.91,22.47 0 top
R22  82.2,28.06 0 top
R23  82.2,26.79 0 top
R24  82.2,25.52 0 top
R25  82.2,24.25 0 top
R26  51.46,24.63 180 top
R27  47.27,26.03 0 top
R28  82.2,22.98 0 top
R29  86.13,43.17 180 top
R30  72.04,31.23 180 top
R31  72.04,19.8 180 top
R32  12.86,8.63 270 top
R33  6.76,8.75 270 top
S1  86.13,39.36 0 top
SW1  82.2,15.36 90 top
TP1  47.78,23.74 0 bottom
TP2  43.46,23.87 0 bottom
U1  69.24,4.82 270 top
U2  69.24,45.08 270 top
U3  3.58,25.52 270 top
U4  31.4,25.77 0 top
U5  39.02,27.8 90 top
U6  72.04,25.52 90 top
U7  16.16,3.93 180 top
U8  82.71,53.2 180 top
U9  16.16,45.84 180 top
U10  77.75,7.36 180 top
U11  9.81,32.88 0 top
U$2  [MPLEX_LOGO]  76.23,56 0 top  (outside the outline)
U$3  [MPLEX_LOGO_SMALL]  22.89,1.01 0 top

### Tracks (layer width: path | path; a pad name or v marks a point on that pad's centre or on a via)
3.3V  (via drill 0.3)  (18 unrouted)
  Top 0.305: C26.+ 14.89,22.84 v14.76,22.22 | v11.71,4.82 11.71,4.18 12.73,3.17 13.53,3.17 C19.2
  Top 0.356: U8.8 U8.7 | C20.2 13.72,45.09 U9.8 U9.7 | C19.2 13.72,3.18 U7.8 U7.7 | U10.8 U10.7
  Top 1.016: U11.3 13.85,25.01 C26.+
  Bottom 0.305: v14.76,22.22 14.76,11.04 11.71,7.99 v11.71,4.82
!BOOT  (1 unrouted)
!RST  (1 unrouted)
DMODE  (5 unrouted)
FORCE  (1 unrouted)
GND  (7 unrouted)
  pour Top (rank 6): -0.35,50.28 -0.35,-0.52 90.45,-0.52 90.45,50.28
  pour Bottom (rank 5): -0.35,50.28 -0.35,-0.52 90.45,-0.52 90.45,50.28
I2ID  (1 unrouted)
I3ID  (2 unrouted)
IGA1  (4 unrouted)
IGA2  (4 unrouted)
IGA3  (4 unrouted)
IGA4  (4 unrouted)
IMUE  (2 unrouted)
ISENSE  (2 unrouted)
MOT1  (1 unrouted)
MOT2  (1 unrouted)
MOT3  (1 unrouted)
MOT4  (1 unrouted)
MOT5  (1 unrouted)
MOT6  (1 unrouted)
MOT7  (1 unrouted)
MOT8  (1 unrouted)
N$1
  Top 0.305: R7.8 63.93,37.96 JP3.16
N$2
  Top 0.305: R7.7 60.7,39.01 JP3.15
N$3  (1 unrouted)
N$4  (1 unrouted)
N$5
  Top 0.305: R7.6 59.9,38.91 JP3.14
N$6
  Top 0.305: R7.5 56.93,38.22 JP3.13
N$7
  Top 0.305: R5.7 50.54,39.01 JP3.11
N$8
  Top 0.305: R5.8 53.77,37.96 JP3.12
N$9
  Top 0.305: R5.6 49.74,38.91 JP3.10
N$10
  Top 0.305: R5.5 46.77,38.22 JP3.9
N$11
  Top 0.305: R4.8 43.55,37.96 JP3.8
N$12
  Top 0.305: R4.7 40.33,39.06 JP3.7
N$13
  Top 0.305: R4.6 39.53,38.86 JP3.6
N$14
  Top 0.305: R4.5 36.56,38.22 JP3.5
N$15
  Top 0.305: R6.8 33.37,37.96 JP3.4
N$16
  Top 0.305: R6.7 30.15,39.09 JP3.3
N$17
  Top 0.305: R6.6 29.35,38.83 JP3.2
N$18
  Top 0.305: R6.5 26.38,38.22 JP3.1
N$19  (1 unrouted)
N$20  (1 unrouted)
N$21  (1 unrouted)
N$22  (1 unrouted)
N$23  (1 unrouted)
N$24  (1 unrouted)
N$25  (1 unrouted)
N$26  (1 unrouted)
N$27  (1 unrouted)
N$28  (1 unrouted)
N$29  (1 unrouted)
N$30  (1 unrouted)
N$31  (1 unrouted)
N$32  (1 unrouted)
N$33  (1 unrouted)
N$34
  Top 0.305: Q2.1 8.86,6.91 9.3,6.47 12.47,6.47 12.86,6.85 R32.2
N$35
  Top 0.305: R8.1 63.57,11.55 JP4.16
N$36
  Top 0.305: R8.2 60.63,10.93 JP4.15
N$37
  Top 0.305: R8.3 59.83,10.68 JP4.14
N$38
  Top 0.305: R8.4 56.63,11.8 JP4.13
N$39
  Top 0.305: R9.1 53.28,11.55 JP4.12
N$40
  Top 0.305: R9.2 50.34,10.8 JP4.11
N$41
  Top 0.305: R9.3 49.54,10.8 JP4.10
N$42
  Top 0.305: R9.4 46.34,11.8 JP4.9
N$43
  Top 0.305: R10.1 43.25,11.55 JP4.8
N$44
  Top 0.305: R10.2 40.31,10.93 JP4.7
N$45
  Top 0.305: R10.3 39.51,10.68 JP4.6
N$46
  Top 0.305: R10.4 36.31,11.8 JP4.5
N$47
  Top 0.305: R11.1 33.04,11.55 JP4.4
N$48
  Top 0.305: R11.2 30.1,10.88 JP4.3
N$49
  Top 0.305: R11.3 29.3,10.73 JP4.2
N$50
  Top 0.305: R11.4 26.1,11.8 JP4.1
N$52  (via drill 0.3)
  Top 0.305: R33.1 6.88,9.73 Q2.3 10.53,9.73 v11.08,10.28 | v13.49,22.47 12.11,22.47 Q1.1
  Bottom 0.305: v11.08,10.28 13.11,10.28 14.13,11.29 14.13,21.83 v13.49,22.47
N$66  (1 unrouted)
PWR  (1 unrouted)
S01
  Top 0.305: R7.4 59.1,45.02 60.15,46.07 66.31,46.07 U2.6
S02
  Top 0.305: R7.3 59.9,44.75 60.56,45.41 U2.7
S03
  Top 0.305: R7.2 60.7,44.26 61.19,44.75 U2.8
S04
  Top 0.305: R7.1 61.5,43.68 61.9,44.08 66.31,44.08 U2.9
S05  (via drill 0.3)
  Top 0.305: R5.1 v51.34,42.33 | v62.64,40.38 62.64,42.71 63.38,43.45 U2.10
  Bottom 0.305: v51.34,42.33 52.94,43.93 60.35,43.93 62.64,41.65 v62.64,40.38
S06  (via drill 0.3)
  Top 0.305: R5.2 50.54,42.96 v50.63,43.04 | v63.4,41.14 63.4,42.43 63.78,42.81 66.31,42.81 U2.11
  Bottom 0.305: v50.63,43.04 52.02,44.44 60.73,44.44 63.15,42.03 63.15,41.39 v63.4,41.14
S07  (via drill 0.3)
  Top 0.305: R5.3 49.74,43.48 v49.94,43.68 | v64.04,41.9 64.29,42.15 U2.12
  Bottom 0.305: v49.94,43.68 51.21,44.95 61.12,44.95 63.78,42.28 63.78,42.15 v64.04,41.9
S08  (via drill 0.3)
  Top 0.305: R5.4 48.94,43.95 v49.3,44.31 | v68.74,41.27 68.5,41.5 U2.13
  Bottom 0.305: v49.3,44.31 50.45,45.46 65.05,45.46 68.74,41.77 v68.74,41.27
S09  (via drill 0.3)
  Top 0.305: R4.1 v41.13,42.33 | v70.03,40.83 72.14,40.83 U2.15
  Bottom 0.305: v41.13,42.33 44.76,45.96 66.45,45.96 67.21,45.2 67.21,44.06 69.5,41.77 69.5,41.37 v70.03,40.83
S10  (via drill 0.3)
  Top 0.305: R4.2 40.33,42.94 v40.44,43.04 | v70.56,41.49 U2.16
  Bottom 0.305: v40.44,43.04 43.87,46.47 66.7,46.47 67.72,45.46 67.72,44.34 v70.56,41.49
S11  (via drill 0.3)
  Top 0.305: R4.3 39.53,43.41 v39.8,43.68 | v67.72,46.47 67.72,45.33 70.89,42.15 U2.17
  Bottom 0.305: v39.8,43.68 43.11,46.98 67.21,46.98 v67.72,46.47
S12  (via drill 0.3)
  Top 0.305: R4.4 38.73,43.9 v39.14,44.31 | v68.35,46.98 68.35,45.46 71,42.81 72.15,42.81 U2.18
  Bottom 0.305: v39.14,44.31 42.32,47.49 67.85,47.49 v68.35,46.98
S13  (via drill 0.3)
  Top 0.305: R6.1 30.97,41.66 v30.97,42.33 | v68.99,47.62 68.99,45.56 71.12,43.42 72.14,43.42 U2.19
  Bottom 0.305: v30.97,42.33 36.63,48 68.61,48 v68.99,47.62
S14  (via drill 0.3)
  Top 0.305: R6.2 30.15,42.94 v30.25,43.04 | v69.62,48.12 69.62,45.66 71.18,44.1 U2.20
  Bottom 0.305: v30.25,43.04 35.72,48.5 69.24,48.5 v69.62,48.12
S15  (via drill 0.3)
  Top 0.305: R6.3 29.35,43.41 v29.62,43.68 | v70.26,48.76 70.26,45.76 71.28,44.75 U2.21
  Bottom 0.305: v29.62,43.68 34.95,49.01 70.01,49.01 v70.26,48.76
S16  (via drill 0.3)
  Top 0.305: R6.4 28.55,43.88 v28.98,44.31 | U2.22 71.35,45.41 70.89,45.86 70.89,49.14 v71.02,49.27
  Bottom 0.305: v28.98,44.31 34.19,49.52 70.77,49.52 v71.02,49.27
S17
  Top 0.305: R8.8 61.37,8.1 61.37,7.36 62.93,5.79 U1.6
S18
  Top 0.305: R8.7 60.73,8.05 60.73,7.23 62.82,5.14 U1.7
S19
  Top 0.305: R8.6 59.97,8.01 59.97,7.23 62.71,4.49 U1.8
S20
  Top 0.305: R8.5 59.08,8.1 59.08,7.23 62.47,3.84 U1.9
S21
  Top 0.305: R9.8 51.21,8.08 51.21,7.23 55.25,3.19 U1.10
S22
  Top 0.305: R9.7 50.45,8.05 50.45,7.23 55.14,2.54 U1.11
S23
  Top 0.305: R9.6 49.56,8.13 49.56,7.36 55.02,1.89 U1.12
S24
  Top 0.305: R9.5 48.8,8.1 48.8,7.36 54.91,1.24 U1.13
S25  (via drill 0.3)  (1 unrouted)
  Top 0.305: R10.8 v41.1,7.41 | 72.13,0.63 70.51,0.63 69.12,2.02 69.12,5.96 70.51,7.36 v70.89,7.36
  Bottom 0.305: v41.1,7.41 44.45,4.05 66.2,4.05 69.5,7.36 v70.89,7.36
S26  (via drill 0.3)
  Top 0.305: R10.7 40.31,6.93 v40.47,6.77 | U1.16 70.66,1.24 69.62,2.28 69.62,5.71 70.39,6.47 v70.89,6.47
  Bottom 0.305: v40.47,6.77 43.69,3.55 66.45,3.55 69.37,6.47 v70.89,6.47
S27  (via drill 0.3)
  Top 0.305: R10.6 39.51,6.46 v39.83,6.14 | U1.17 71.28,1.89 71.28,1.9 70.77,1.9 70.13,2.53 70.13,5.32 70.39,5.58 v70.89,5.58
  Bottom 0.305: v39.83,6.14 42.93,3.04 66.7,3.04 69.24,5.58 v70.89,5.58
S28  (via drill 0.3)
  Top 0.305: R10.5 38.71,5.89 v39.14,5.45 | U1.18 71.02,2.53 70.7,2.85 70.7,4.5 v70.89,4.69
  Bottom 0.305: v39.14,5.45 42.07,2.53 69.62,2.53 70.89,3.8 v70.89,4.69
S29  (via drill 0.3)
  Top 0.305: R11.8 v30.9,7.41 v30.89,7.41 | U1.19 73.41,3.19 v73.94,2.66
  Bottom 0.305: v30.89,7.41 36.27,2.02 73.31,2.02 v73.94,2.66
S30  (via drill 0.3)
  Top 0.305: R11.7 30.1,6.88 v30.25,6.72 | U1.20 73.77,3.84 74.58,3.04 v74.58,2.15
  Bottom 0.305: v30.25,6.72 35.46,1.51 73.94,1.51 v74.58,2.15
S31  (via drill 0.3)
  Top 0.305: R11.6 29.3,6.41 v29.62,6.09 | U1.21 74.01,4.49 75.21,3.29 v75.21,1.64
  Bottom 0.305: v29.62,6.09 34.7,1.01 74.58,1.01 v75.21,1.64
S32  (via drill 0.3)
  Top 0.305: R11.5 28.5,5.94 v28.98,5.45 | U1.22 74.38,5.14 75.85,3.67 v75.85,1.13
  Bottom 0.305: v28.98,5.45 33.94,0.5 75.21,0.5 v75.85,1.13
SCL  (4 unrouted)
SCL33  (2 unrouted)
SDA  (4 unrouted)
SDA33  (2 unrouted)
TERM  (2 unrouted)
VCC  (24 unrouted)
  Top 0.635: 7.23,26.47 U11.1
  Top 1.016: U11.1 Q1.2
VCCIO  (8 unrouted)
  Top 0.305: 18.6,45.09 arc90 C22.2
  Top 0.356: U9.1 18.6,45.09 | C22.2 20.02,43.87 C3.+ | U7.1 18.6,3.18 arc-90 C21.2 18.71,3.09 19.48,3.09 19.94,3.55 C5.+
  Top 1.524: JP6.16 63.78,35.68 JP6.15 61.24,35.42 JP6.14 58.7,35.68 JP6.13 56.16,35.42 JP6.12 53.62,35.68 JP6.11 51.08,35.42 JP6.10 48.54,35.68 JP6.9 46,35.42 JP6.8 43.46,35.68 JP6.7 40.92,35.42 JP6.6 38.38,35.68 JP6.5 35.84,35.42 JP6.4 33.3,35.68 JP6.3 30.76,35.42 JP6.2 28.22,35.68 JP6.1 25.92,35.66 C3.+ 20.02,35.12 | JP2.16 63.78,14.34 JP2.15 61.24,14.09 JP2.14 58.7,14.34 JP2.13 56.16,14.09 JP2.12 53.62,14.34 JP2.11 51.08,14.09 JP2.10 48.54,14.34 JP2.9 46,14.09 JP2.8 43.46,14.34 JP2.7 40.92,14.09 JP2.6 38.38,14.34 JP2.5 35.84,14.09 JP2.4 33.3,14.34 JP2.3 30.76,14.09 JP2.2 28.22,14.34 JP2.1 25.92,14.33 C5.+ 10.75,14.2 Q1.3
VSENSE  (2 unrouted)